# EAGLE design Sensors_SR_July 2015 (EAGLE 7.2.0)
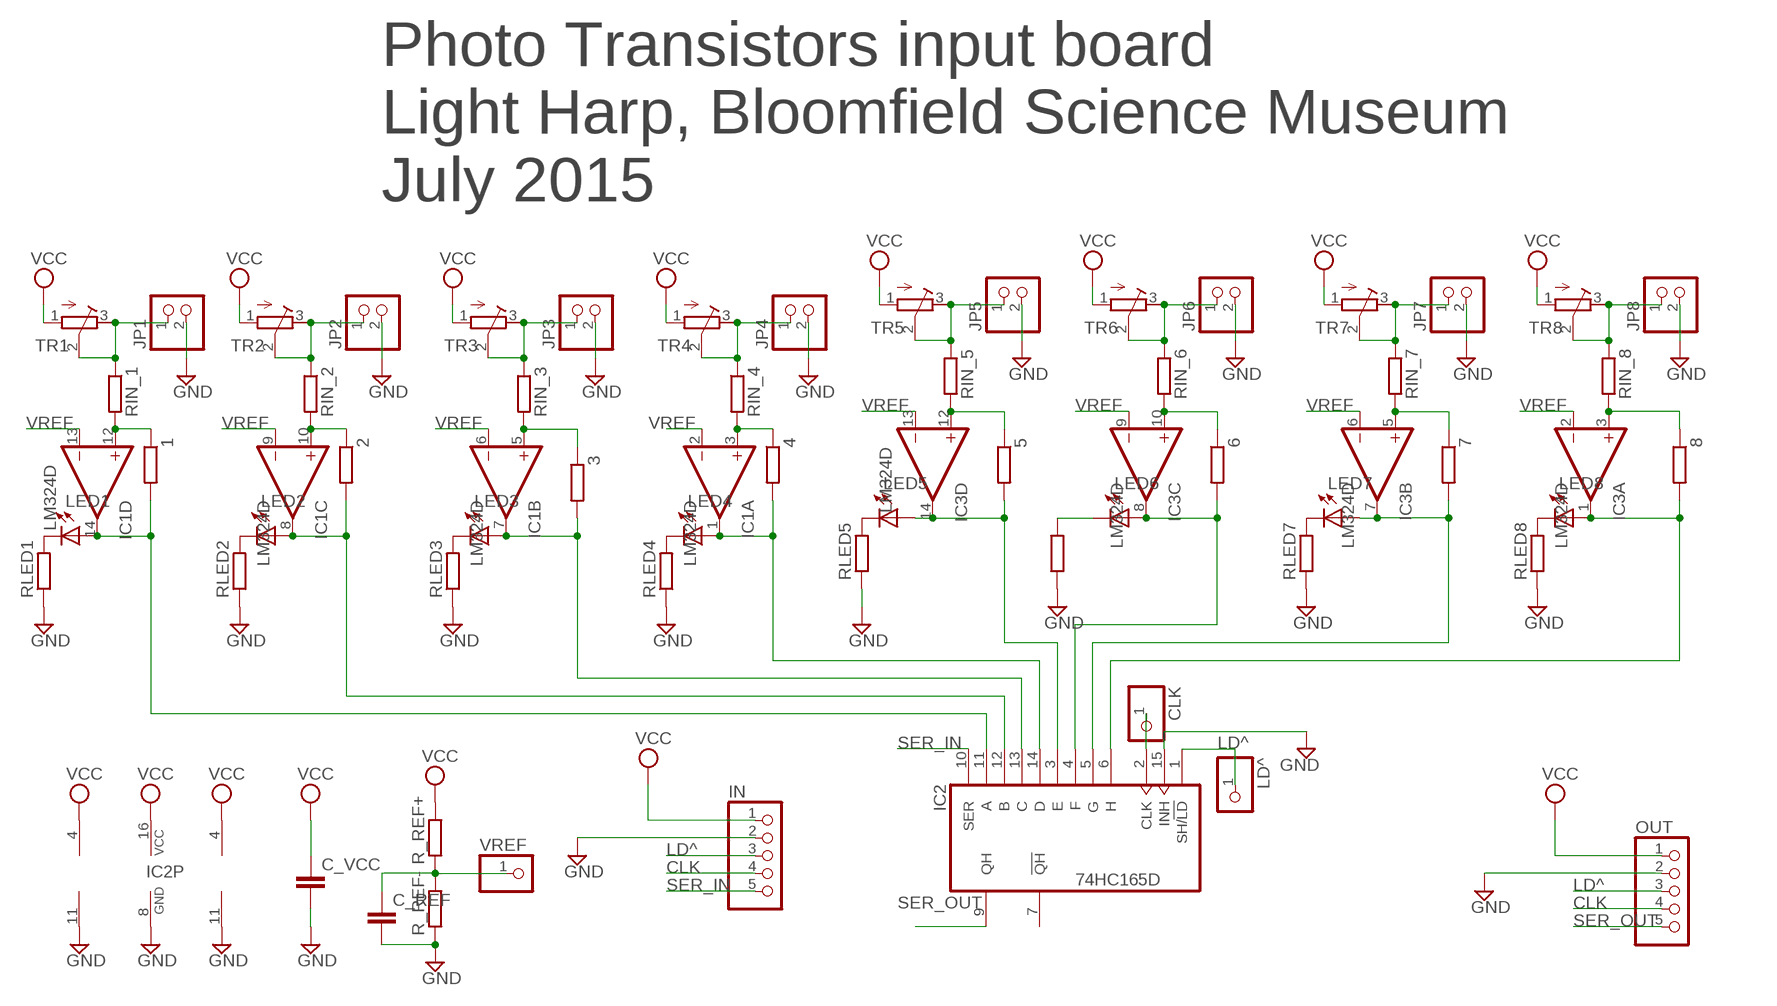
[diagram p0: schematic, sheet 1]

## Parts
1  R-EU_R0603  [R0603]
2  R-EU_R0603  [R0603]
3  R-EU_R0603  [R0603]
4  R-EU_R0603  [R0603]
5  R-EU_R0603  [R0603]
6  R-EU_R0603  [R0603]
7  R-EU_R0603  [R0603]
8  R-EU_R0603  [R0603]
C_REF  C-EUC0603  [C0603]
C_VCC  C-EUC0805  [C0805]
CLK  PINHD-1X1  [1X01]
IC1  LM324D  [SO14]
IC2  74HC165D  [SO16]
IC3  LM324D  [SO14]
IN  PIN_HEAD_1X5_MARKED  [1X5_MARKED]
JP1  PINHD-1X2SQ&RND  [1X02_SQ&ROUND]
JP2  PINHD-1X2SQ&RND  [1X02_SQ&ROUND]
JP3  PINHD-1X2SQ&RND  [1X02_SQ&ROUND]
JP4  PINHD-1X2SQ&RND  [1X02_SQ&ROUND]
JP5  PINHD-1X2SQ&RND  [1X02_SQ&ROUND]
JP6  PINHD-1X2SQ&RND  [1X02_SQ&ROUND]
JP7  PINHD-1X2SQ&RND  [1X02_SQ&ROUND]
JP8  PINHD-1X2SQ&RND  [1X02_SQ&ROUND]
LD^  PINHD-1X1  [1X01]
LED1  LEDCHIPLED_0805  [CHIPLED_0805]
LED2  LEDCHIPLED_0805  [CHIPLED_0805]
LED3  LEDCHIPLED_0805  [CHIPLED_0805]
LED4  LEDCHIPLED_0805  [CHIPLED_0805]
LED5  LEDCHIPLED_0805  [CHIPLED_0805]
LED6  LEDCHIPLED_0805  [CHIPLED_0805]
LED7  LEDCHIPLED_0805  [CHIPLED_0805]
LED8  LEDCHIPLED_0805  [CHIPLED_0805]
OUT  PIN_HEAD_1X5_MARKED  [1X5_MARKED]
R_REF+  R-EU_R0603  [R0603]
R_REF-  R-EU_R0603  [R0603]
RIN_1  R-EU_R0603  [R0603]
RIN_2  R-EU_R0603  [R0603]
RIN_3  R-EU_R0603  [R0603]
RIN_4  R-EU_R0603  [R0603]
RIN_5  R-EU_R0603  [R0603]
RIN_6  R-EU_R0603  [R0603]
RIN_7  R-EU_R0603  [R0603]
RIN_8  R-EU_R0603  [R0603]
RLED1  R-EU_R0603  [R0603]
RLED2  R-EU_R0603  [R0603]
RLED3  R-EU_R0603  [R0603]
RLED4  R-EU_R0603  [R0603]
RLED5  R-EU_R0603  [R0603]
RLED6  R-EU_R0603  [R0603]
RLED7  R-EU_R0603  [R0603]
RLED8  R-EU_R0603  [R0603]
TR1  R-TRIMM64W_W  [RTRIM64W_W]
TR2  R-TRIMM64W_W  [RTRIM64W_W]
TR3  R-TRIMM64W_W  [RTRIM64W_W]
TR4  R-TRIMM64W_W  [RTRIM64W_W]
TR5  R-TRIMM64W_W  [RTRIM64W_W]
TR6  R-TRIMM64W_W  [RTRIM64W_W]
TR7  R-TRIMM64W_W  [RTRIM64W_W]
TR8  R-TRIMM64W_W  [RTRIM64W_W]
VREF  PINHD-1X1  [1X01]

## Nets
CLK: CLK.1 IC2.2(CLK) IN.4 OUT.4
GND: C_REF.2 C_VCC.2 IC1.11(P:V-) IC2.8(GND) IC2.15(INH) IC3.11(P:V-) IN.2 JP1.2 JP2.2 JP3.2 JP4.2 JP5.2 JP6.2 JP7.2 JP8.2 OUT.2 R_REF-.1 RLED1.1 RLED2.1 RLED3.1 RLED4.1 RLED5.1 RLED6.1 RLED7.1 RLED8.1
LD^: IC2.1(SH/!LD) IN.3 LD^.1 OUT.3
N$1: 1.2 IC1.14(D:OUT) IC2.11(A) LED1.A
N$2: 1.1 IC1.12(D:+IN) RIN_1.2
N$3: LED1.C RLED1.2
N$4: JP1.1 RIN_1.1 TR1.2(S) TR1.3(A)
N$5: JP2.1 RIN_2.1 TR2.2(S) TR2.3(A)
N$6: JP3.1 RIN_3.1 TR3.2(S) TR3.3(A)
N$7: JP4.1 RIN_4.1 TR4.2(S) TR4.3(A)
N$8: JP5.1 RIN_5.1 TR5.2(S) TR5.3(A)
N$9: JP6.1 RIN_6.1 TR6.2(S) TR6.3(A)
N$10: JP7.1 RIN_7.1 TR7.2(S) TR7.3(A)
N$11: JP8.1 RIN_8.1 TR8.2(S) TR8.3(A)
N$12: 2.2 IC1.8(C:OUT) IC2.12(B) LED2.A
N$13: 2.1 IC1.10(C:+IN) RIN_2.2
N$14: LED2.C RLED2.2
N$15: 3.1 IC1.5(B:+IN) RIN_3.2
N$16: 3.2 IC1.7(B:OUT) IC2.13(C) LED3.A
N$17: 4.2 IC1.1(A:OUT) IC2.14(D) LED4.A
N$18: 4.1 IC1.3(A:+IN) RIN_4.2
N$19: LED5.C RLED5.2
N$20: LED4.C RLED4.2
N$21: 5.1 IC3.12(D:+IN) RIN_5.2
N$22: 5.2 IC2.3(E) IC3.14(D:OUT) LED5.A
N$23: 6.2 IC2.4(F) IC3.8(C:OUT) LED6.A
N$24: 6.1 IC3.10(C:+IN) RIN_6.2
N$25: 7.2 IC2.5(G) IC3.7(B:OUT) LED7.A
N$26: LED6.C RLED6.2
N$27: LED3.C RLED3.2
N$28: LED7.C RLED7.2
N$29: 7.1 IC3.5(B:+IN) RIN_7.2
N$30: 8.2 IC2.6(H) IC3.1(A:OUT) LED8.A
N$32: LED8.C RLED8.2
N$34: 8.1 IC3.3(A:+IN) RIN_8.2
SER_IN: IC2.10(SER) IN.5
SER_OUT: IC2.9(QH) OUT.5
VCC: C_VCC.1 IC1.4(P:V+) IC2.16(VCC) IC3.4(P:V+) IN.1 OUT.1 R_REF+.2 TR1.1(E) TR2.1(E) TR3.1(E) TR4.1(E) TR5.1(E) TR6.1(E) TR7.1(E) TR8.1(E)
VREF: C_REF.1 IC1.2(A:-IN) IC1.6(B:-IN) IC1.9(C:-IN) IC1.13(D:-IN) IC3.2(A:-IN) IC3.6(B:-IN) IC3.9(C:-IN) IC3.13(D:-IN) R_REF+.1 R_REF-.2 VREF.1
Unconnected: IC2.7(!QH)

## Notes on the sheet
- Photo Transistors input board
  Light Harp, Bloomfield Science Museum  
  July 2015

## Library data of the parts
1-8 R_REF+ R_REF- RIN_1-RIN_8 RLED1-RLED8 = rcl:R-EU_: RESISTOR, European symbol
C_REF C_VCC = rcl:C-EU: CAPACITOR, European symbol
CLK LD^ VREF = pinhead:PINHD-1X1: PIN HEADER
IC1 IC3 = Amir_May_15:LM324: OP AMP
IC2 = 74xx-eu:74*165: 8-bit parallel load SHIFT REGISTER
IN OUT = Amir_May_15:PIN_HEAD_1X5_MARKED
JP1-JP8 = Amir_May_15:PINHD-1X2: PIN HEADER
LED1-LED8 = Amir_May_15:LED: LED OSRAM: - CHIPLED LG R971, LG N971, LY N971, LG Q971, LY Q971, LO R971, LY R971 LH N974, LH R974 LS Q976, LO Q976, LY Q976 LO Q996 - Hyper CHIPLED LW Q18S LB Q993, LB Q99A, LB R99A - SideLED LS A670, LO A670, LY A670, LG A670, LP A670 LB A673, LV A673, LT A673, LW A673 LH A674 LY A675 LS A676, LA A676, LO A676, LY A676, LW A676 LS A679, LY A679, LG A679 - Hyper Micro SIDELED® LS Y876, LA Y876, LO Y876, LY Y876 LT Y87S - SmartLED LW L88C, LW L88S LB L89C, LB L89S, LG L890 LS L89K, LO L89K, LY L89K LS L896, LA L896, LO L896, LY L896 - TOPLED LS T670, LO T670, LY T670, LG T670, LP T670 LSG T670, LSP T670, LSY T670, LOP T670, LYG T670 LG T671, LOG T671, LSG T671 LB T673, LV T673, LT T673, LW T673 LH T674 LS T676, LA T676, LO T676, LY T676, LB T676, LH T676, LSB T676, LW T676 LB T67C, LV T67C, LT T67C, LS T67K, LO T67K, LY T67K, LW E67C LS E67B, LA E67B, LO E67B, LY E67B, LB E67C, LV E67C, LT E67C LW T67C LS T679, LY T679, LG T679 LS T770, LO T770, LY T770, LG T770, LP T770 LB T773, LV T773, LT T773, LW T773 LH T774 LS E675, LA E675, LY E675, LS T675 LS T776, LA T776, LO T776, LY T776, LB T776 LHGB T686 LT T68C, LB T68C - Hyper Mini TOPLED® LB M676 - Mini TOPLED Santana® LG M470 LS M47K, LO M47K, LY M47K Source: http://www.osram.convergy.de/
TR1-TR8 = Amir_May_15:R-TRIMM: Trimm resistor

## Board
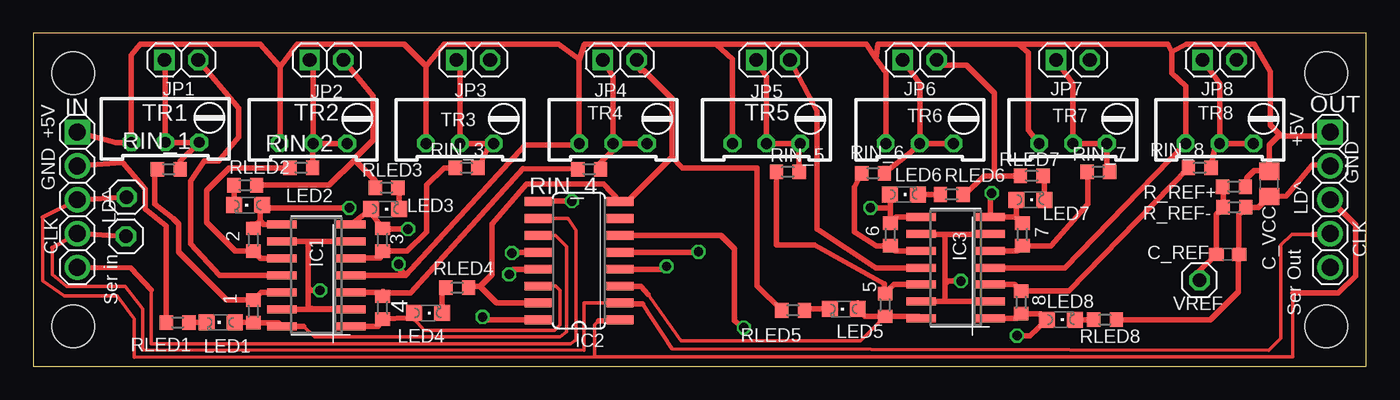
[diagram p1: board, top side]
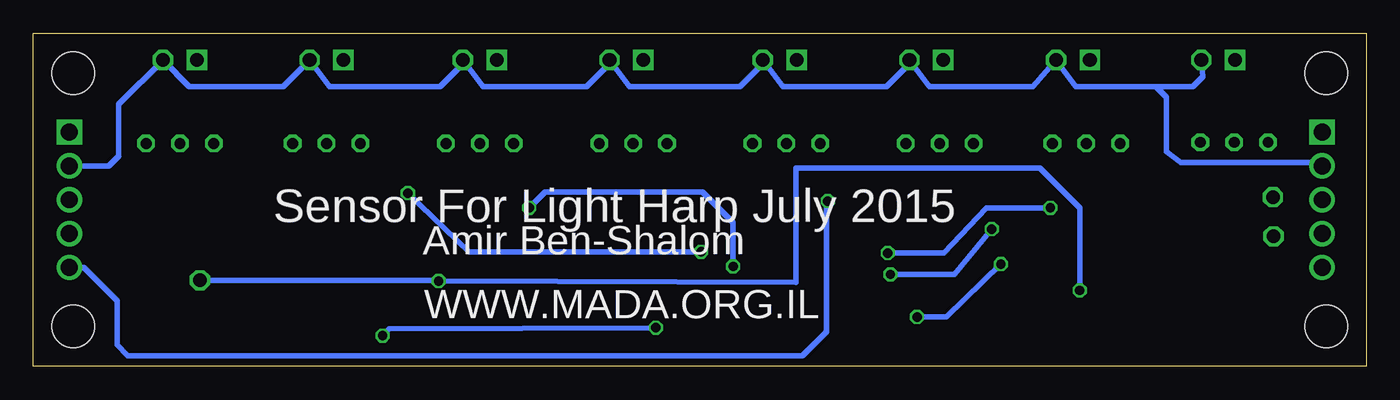
[diagram p2: board, bottom side, seen from below]

Size 100 x 25 mm. Coordinates in mm from the lower left corner, seen from the top.
Outline: 0,0 100,0 100,25 0,25 0,0
Copper layers (1*16): Top 0.035mm / dielectric 1.5mm / Bottom 0.035mm
Design rules "Smart-prototyping": minimum track width 7mil, minimum drill 12mil, track to track 7mil, track to pad 7mil, pad to pad 7mil, via to via 7mil, smd to smd 0mil, copper to edge 20mil, drill to drill 10mil, minimum pad ring 10mil, minimum via ring 6mil, stop-mask expansion 2mil, vias tented up to drill 25mil, thermal gap 10mil
Holes 3.2 mm at 97,3 97,22 3,22 3,3

### Footprints (pad centres in the part's own frame; a part is rotated, then mirrored left to right if it is on the bottom)
R0603 = smd 1 x 1.1: 1 -0.85,0; 2 0.85,0
C0603 = smd 1.1 x 1: 1 -0.85,0; 2 0.85,0
C0805 = smd 1.3 x 1.5: 1 -0.95,0; 2 0.95,0
1X01 = drill 1.016 octagon: 1 0,0
SO14 = smd 0.6 x 2.2: 1 -3.81,-2.6; 2 -2.54,-2.6; 3 -1.27,-2.6; 4 0,-2.6; 5 1.27,-2.6; 6 2.54,-2.6; 7 3.81,-2.6; 8 3.81,2.6; 9 2.54,2.6; 10 1.27,2.6; 11 0,2.6; 12 -1.27,2.6; 13 -2.54,2.6; 14 -3.81,2.6
SO16 = smd 0.66 x 2.032: 1 -4.445,-3.073; 2 -3.175,-3.073; 3 -1.905,-3.073; 4 -0.635,-3.073; 5 0.635,-3.073; 6 1.905,-3.073; 7 3.175,-3.073; 8 4.445,-3.073; 9 4.445,3.073; 10 3.175,3.073; 11 1.905,3.073; 12 0.635,3.073; 13 -0.635,3.073; 14 -1.905,3.073; 15 -3.175,3.073; 16 -4.445,3.073
1X5_MARKED = drill 1.27 square: 1 -5.08,0 | drill 1.27: 2 -2.54,0; 3 0,0; 4 2.54,0; 5 5.08,0
1X02_SQ&ROUND = drill 1.016 square: 1 -1.27,0 | drill 1.016 octagon: 2 1.27,0
CHIPLED_0805 = smd 1.2 x 1.2: A 0,-1.05; C 0,1.05
RTRIM64W_W = drill 0.813 octagon: 1 1.27,-2.54; 2 1.27,0; 3 1.27,2.54

### Placement (x,y rotation side)
1  16.51,4.12 270 top
2  16.5,9.5 90 top
3  26.2,9.5 90 top
4  26.2,4.4 270 top
5  63.9,4.6 270 top
6  64.3,9.9 90 top
7  74.2,9.9 90 top
8  74.1,4.8 270 top
C_REF  89.6,8.4 0 top
C_VCC  92.72,13.7 270 top
CLK  6.95,9.75 0 top
IC1  21.24,6.82 90 top
IC2  40.94,7.92 90 top
IC3  69.2,7.4 90 top
IN  3.3,12.5 270 top
JP1  11.1,23 0 top
JP2  22,23 0 top
JP3  33,23 0 top
JP4  44,23 0 top
JP5  55.5,23 0 top
JP6  66.5,23 0 top
JP7  78,23 0 top
JP8  89,23 0 top
LD^  7,12.7 0 top
LED1  14.04,3.3 90 top
LED2  16.1,12.1 90 top
LED3  26.4,11.8 270 top
LED4  29.6,4 270 top
LED5  60.8,4.3 90 top
LED6  65.3,12.9 270 top
LED7  74.8,12.5 270 top
LED8  77.1,3.5 270 top
OUT  97.3,12.5 270 top
R_REF+  90.08,13.48 0 top
R_REF-  90.12,11.93 180 top
RIN_1  10.17,14.79 180 top
RIN_2  20.1,14.9 180 top
RIN_3  32.5,14.9 180 top
RIN_4  41.7,14.8 180 top
RIN_5  56.6,14.6 180 top
RIN_6  63,14.5 180 top
RIN_7  79.9,14.6 180 top
RIN_8  87.5,14.9 180 top
RLED1  10.83,3.28 0 top
RLED2  15.9,13.6 180 top
RLED3  26.5,13.4 0 top
RLED4  31.8,5.9 180 top
RLED5  57,4.2 0 top
RLED6  68.9,12.9 180 top
RLED7  74.9,14.3 0 top
RLED8  80.4,3.5 180 top
TR1  9.9,18.08 270 top
TR2  21,18 270 top
TR3  32,18 270 top
TR4  43.5,18 270 top
TR5  55,18 270 top
TR6  66.5,18 270 top
TR7  78,18 270 top
TR8  89,18 270 top
VREF  87.49,6.45 270 top

### Tracks (layer width: path | path; a pad name or v marks a point on that pad's centre or on a via)
CLK
  Top 0.254: IC2.2 41.3,4.75 41.3,1.2 8.2,1.23 8.2,4.3 6.9,6 2.5,6 1.4,6.9 1.4,8.9 | 45.7,4.7 47.9,1.3 92.7,1.2 93.6,2.1 93.6,9.1 94.4,9.9 95.94,9.9
  Top 0.305: 1.4,8.9 IN.4
  Top 0.406: 45.7,4.7 44.06,4.7 IC2.2 | 95.94,9.9 97.24,9.9 OUT.4 | IN.4 CLK.1
GND
  Top 0.406: IC1.11 13.98,6.82 11.8,9.2 11.8,13.9 12.8,15.4 13.9,15.4 15.4,17.2 15.4,19.37 JP1.2 | RLED2.1 22.2,13.6 24.1,15.5 | 24.1,15.5 24.1,15.6 25.5,17 25.5,20.27 JP2.2 | RLED1.1 9.98,10.52 8.4,11.8 8.4,13.3 6.7,15.3 IN.2 | RLED3.1 25.65,13.95 24.1,15.5 | IC2.15 34.76,4.75 33.5,6 | 33.5,6 32.35,6 RLED4.1 | 47.9,15.7 44.56,12.37 IC2.8 42.78,13.7 37,13.7 34.4,10.7 34.4,6.9 33.5,6 | 47.9,15.7 47.9,20.1 45.8,22.2 45.57,22.2 JP4.2 | IC3.11 63.2,7.4 58.8,10.3 58.8,19.17 JP5.2 | RLED5.1 54.3,6.05 54.3,14.9 48.7,14.9 47.9,15.7 | RLED8.1 88.3,3.5 90.4,5.6 90.4,8.35 C_REF.2 90.45,11.41 R_REF-.1 91.9,11.93 C_VCC.2 92.75,12.75 94,12.8 95.94,15.1 97.24,15.1 OUT.2 | RLED6.1 69.9,12.9 71.3,14.3 72.2,14.3 | 72.2,14.3 RLED7.1 | JP6.2 67.87,22.6 70,22.6 72.1,20.5 72.1,14.4 72.2,14.3
  Bottom 0.406: JP1.2 12.27,21.73 13,21 15.8,21 | 15.8,21 21.77,21 JP2.2 25,21 32.77,21 JP3.2 34.5,22.5 36,21 43.77,21 JP4.2 45.5,22.5 47,21 55.27,21 JP5.2 57,22.5 58.5,21 66.27,21 JP6.2 68,22.5 69.5,21 77.77,21 JP7.2 81.27,21 88.3,21 90.27,22.97 JP8.2 93.6,19.67 93.6,15.8 94.36,15.04 OUT.2 | 15.8,21 15.01,20.21 15.01,16.11 13.9,15.3 3.38,15.3 3.38,15.36 IN.2
LD^
  Top 0.254: 42.1,0.7 7.56,0.66 7.56,3.54 6.3,5.3 2.3,5.3 0.7,6.4 0.7,11.2 | 42.1,0.7 42.1,3.1 42.4,3.4 | 42.1,0.7 94.5,0.7 94.5,5.5
  Top 0.305: 0.7,11.2 IN.3
  Top 0.406: 42.4,3.4 43.94,3.4 IC2.1 | 94.5,5.5 97.9,5.5 99.2,6.8 99.2,10.6 OUT.3 | 6.9,12.6 LD^.1 IN.3
N$1
  Top 0.254: 20.29,3.01 21.1,2.2 39.5,2.2 40,2.6 40,9 39.17,9.82 IC2.11
  Top 0.406: 16.4,3.38 1.2 | LED1.A 16.48,3.3 1.2 | 1.2 18.38,3.27 IC1.14 20.29,3.01
N$2
  Top 0.406: IC1.12 17.09,5.55 1.1 16.48,5 14.5,5 10.9,8.6 10.9,10.7 10.51,11.09 9.1,12.2 9.1,14.67 RIN_1.2
N$3
  Top 0.406: RLED1.2 12.97,3.28 LED1.C
N$4
  Top 0.406: TR1.2 TR1.3 11.02,15.39 RIN_1.1 | TR1.2 9.9,22.33 JP1.1 | TR1.2 | 10.02,16.69 TR1.2
N$5
  Top 0.406: TR2.3 TR2.2 | TR2.2 21,22.23 JP2.1 | RIN_2.1 20.95,16.68 TR2.2
N$6
  Top 0.406: JP3.1 32,22.23 TR3.2 TR3.3 34.05,16.24 RIN_3.1
N$7
  Top 0.406: TR4.3 44,16.73 | 44,16.73 TR4.2 43.5,21.73 JP4.1 | RIN_4.1 42.55,15.28 44,16.73
N$8
  Top 0.406: JP5.1 55,21.73 TR5.2 TR5.3 57.45,16.64 RIN_5.1
N$9
  Top 0.406: TR6.3 TR6.2 | TR6.2 66.5,21.23 JP6.1 | RIN_6.1 65.85,16.08 TR6.2
N$10
  Top 0.406: JP7.1 78,21.23 TR7.2 TR7.3 80.54,14.89 RIN_7.1
N$11
  Top 0.406: TR8.3 TR8.2 | TR8.2 89,21.23 JP8.1 | RIN_8.1 88.65,16.38 TR8.2
N$12  (via drill 0.7)
  Top 0.406: 2.2 16.34,10.69 16.79,10.69 17,10.9 | 17,10.9 17,11.6 | 17,11.6 17,11.95 LED2.A | 17,10.9 17.27,10.63 IC1.8 | IC2.12 36.34,8.55 v35.9,8.5 | v23.7,11.9 17.3,11.9 17,11.6
  Bottom 0.406: v35.9,8.5 31.7,8.5 28.5,11.9 v23.7,11.9
N$13
  Top 0.406: IC1.10 17.06,8.09 2.1 15.15,8.65 13,10.8 13,13.2 14.7,14.9 RIN_2.2
N$14
  Top 0.406: RLED2.2 LED2.C
N$15
  Top 0.406: IC1.5 23.84,8.15 26,8.15 3.1 28.05,8.65 29.5,10.1 29.5,13.6 30.8,14.9 RIN_3.2
N$16  (via drill 0.7)
  Top 0.406: IC1.7 LED3.A 25.35,11.5 3.2 26.55,10.3 v28.1,10.3 | IC2.13 36.02,7.29 v35.7,6.9
  Bottom 0.406: v35.7,6.9 30.9,6.9 v28.1,10.3
N$17
  Top 0.254: 28.55,3.55 29.3,2.7 39.1,2.7 39.5,3.1 39.5,5.7 39.19,6.01 IC2.14
  Top 0.406: IC1.1 25.86,3.01 4.2 28.2,3.65 LED4.A 28.55,3.55
N$18
  Top 0.406: RIN_4.2 36.75,14.85 28.3,5.5 26.65,5.5 4.1 26.24,5.61 26.18,5.55 IC1.3
N$19
  Top 0.406: LED5.C 57.95,4.3 RLED5.2
N$20
  Top 0.406: LED4.C 30.65,5.8 RLED4.2
N$21
  Top 0.406: RIN_5.2 55.75,9.1 58.6,9.1 63.85,6.2 5.1 64.58,6.13 IC3.12
N$22
  Top 0.254: 46.1,5.4 48.6,1.9 62.05,1.9 5.2
  Top 0.406: IC3.14 66.44,3.75 5.2 62.4,3.75 LED5.A 61.85,4.75 | 46.1,5.4 45.6,6 44.03,6 IC2.3
N$23  (via drill 0.7)
  Top 0.406: IC3.8 64.76,11.21 6.2 64.3,11.9 | 64.3,11.9 64.3,12.75 LED6.A | IC2.4 47.28,7.29 v47.5,7.5 | v62.8,11.9 64.3,11.9
  Bottom 0.406: v47.5,7.5 47.5,10.8 49.8,13.1 61.6,13.1 v62.8,11.9
N$24
  Top 0.406: IC3.10 64.68,8.67 6.1 63.25,9.05 61.6,10.1 61.6,13.45 RIN_6.2
N$25  (via drill 0.7)
  Top 0.406: 73.74,11.21 IC3.7 71.8,12.9 v71.9,13 | 73.74,11.21 7.2 | IC2.5 49.85,8.55 v49.9,8.6 | LED7.A 73.75,11.22 73.74,11.21
  Bottom 0.406: v49.9,8.6 67.3,8.6 v71.9,13
N$26
  Top 0.406: LED6.C RLED6.2
N$27
  Top 0.406: LED3.C 27.45,13.3 RLED3.2
N$28
  Top 0.406: LED7.C 75.85,14.2 RLED7.2
N$29
  Top 0.406: IC3.5 73.82,8.67 7.1 76.35,9.05 79.1,12.2 79.1,14.55 RIN_7.2
N$30  (via drill 0.7)
  Top 0.406: IC3.1 73.74,3.59 8.2 75.6,3.95 LED8.A 74.75,2.3 v73.8,2.3 | IC2.6 51.58,9.82 52.6,8.8 52.6,3.4 v53.3,2.9
  Bottom 0.406: v53.3,2.9 73.3,2.8 v73.8,2.3
N$32
  Top 0.406: LED8.C RLED8.2
N$34
  Top 0.406: IC3.3 73.62,6.13 8.1 77.7,5.65 RIN_8.2
SER_IN
  Top 0.254: 8.85,5.72 8.85,1.69 40.3,1.7 40.7,2 40.7,10.2 40.1,11.1 IC2.10
  Top 0.406: 8.85,5.72 7.29,7.4 IN.5
SER_OUT  (via drill 0.7)
  Top 0.406: v40.4,12.4 37.9,12.4 IC2.9
  Bottom 0.406: OUT.5 96.22,7.42 93.7,4.9 93.7,1.6 92.9,0.8 42.3,0.8 40.5,2.6 40.5,12.3 v40.4,12.4
VCC  (via drill 0.7)
  Top 0.406: 18.5,22.5 17,24.2 8,24.2 7.36,23.36 TR1.1 6.19,16.78 IN.1 | 18.5,22.5 18.5,16.77 TR2.1 | TR3.1 29.46,22.54 | 29.46,22.54 27.8,24.2 19.8,24.2 18.5,22.5 | 40.96,23 TR4.1 40.53,16.6 36.9,16.6 27.92,6.82 | 40.96,23 40.96,23.04 39.4,24.2 30.82,24.2 29.46,22.54 | TR5.1 52.46,23.04 51.2,24.2 | 51.2,24.2 62.5,24.2 63.23,23.09 | 51.2,24.2 41.36,24.2 40.96,23 | TR6.1 63.96,22.04 63.23,23.09 | TR7.1 74.66,17.74 74.66,23.54 73.9,24.2 | 73.9,24.2 85.1,24.2 85.4,23.6 | 73.9,24.2 63.38,24.2 63.23,23.09 | 85.4,23.6 85.4,22 86.46,21.04 TR8.1 86.39,16.8 86.4,16.7 77.4,7.4 IC3.4 | IC1.4 27.92,6.82 | IC2.16 33.92,3.48 v33.7,3.7 | v27.41,7.67 27.4,7.34 27.92,6.82 | 85.4,23.6 86.5,24.2 91.6,24.2 92.8,22.1 92.8,18.1 93.5,17.4 | 93.5,17.4 93.6,17.3 97.02,17.3 OUT.1 | 93.5,17.4 92.72,16.62 C_VCC.1 92.67,14.7 91.6,14.7 91.03,14.13 R_REF+.2
  Bottom 0.406: v33.7,3.7 31.5,3.7 v27.41,7.67
VREF  (via drill 0.7)
  Top 0.406: IC1.13 IC1.2 23.82,4.3 21.2,4.3 20.6,4.4 20.6,5.9 | IC1.9 20.6,9.36 | 20.6,9.36 IC1.6 | 20.6,5.9 20.6,9.36 | IC3.13 68.4,4.86 | 68.4,4.86 IC3.2 | IC3.6 71.74,9.94 71.7,9.9 68.4,9.9 | 68.4,9.9 66.64,9.9 IC3.9 | 68.4,9.9 68.4,6.2 | 68.4,6.2 68.4,4.86 | v69.6,6.4 68.6,6.4 68.4,6.2 | VREF.1 87.49,7.14 C_REF.1 88.75,11.41 R_REF-.2 89.27,13.42 R_REF+.1 | v21.5,5.7 20.8,5.7 20.6,5.9
  Bottom 0.406: VREF.1 69.65,6.45 v69.6,6.4 42.8,6.3 42.8,14.9 24.5,14.9 21.5,11.9 v21.5,5.7

### Text on the board
tNames: +5V | GND | GND | +5V | LD^ | Ser in | CLK | Ser Out
bNames: Sensor For Light Harp July 2015 | Amir Ben-Shalom | WWW.MADA.ORG.IL